# Altium schematic sheet SCH_TOP.SchDoc: TP Final - Reloj - BLK
size A4; Author: Luciano Lopez; CompanyName: UTN - FRBA; Revision: 1; SheetNumber: 1; SheetTotal: 10
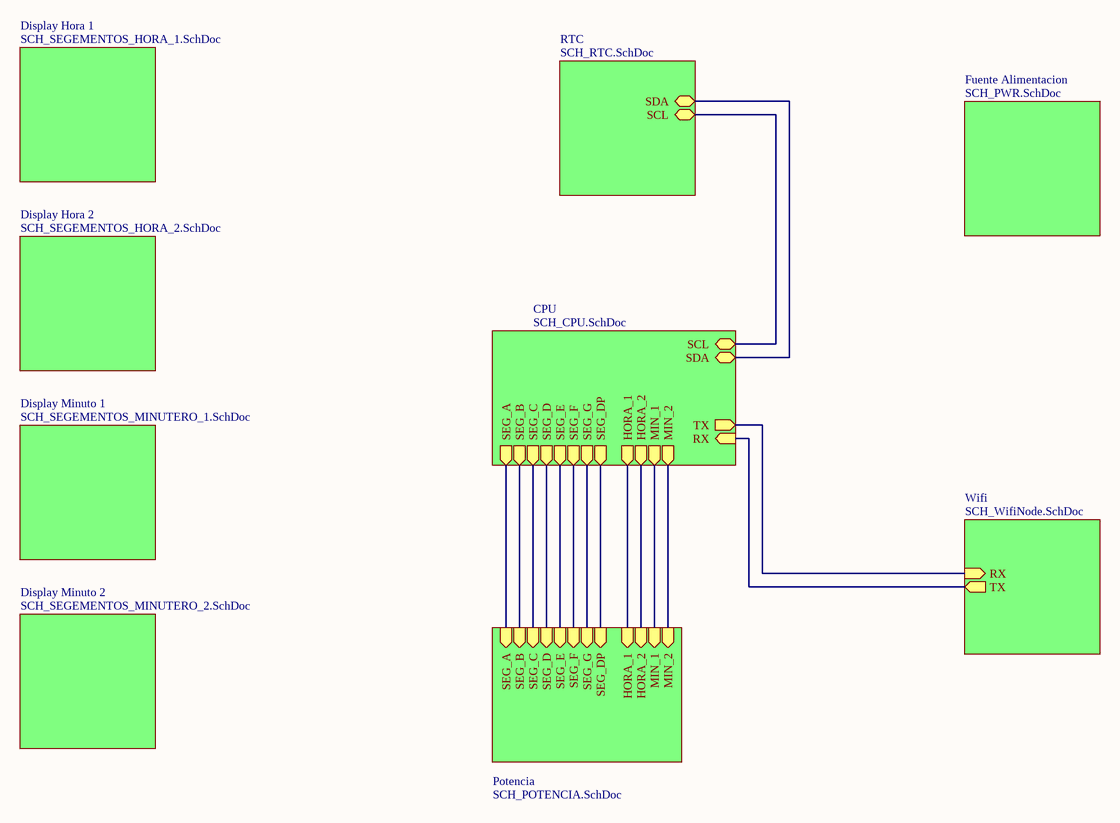
[diagram p0: SCH_TOP.SchDoc]

## Sub-sheets
CPU = SCH_CPU.SchDoc: SCL (bidir), SDA (bidir), TX (out), RX (in), HORA_2 (out), HORA_1 (out), SEG_G (out), SEG_F (out), SEG_D (out), SEG_E (out), SEG_C (out), SEG_B (out), SEG_A (out), MIN_1 (out), MIN_2 (out), SEG_DP (out)
Display Hora 1 = SCH_SEGEMENTOS_HORA_1.SchDoc: no entries
Display Hora 2 = SCH_SEGEMENTOS_HORA_2.SchDoc: no entries
Display Minuto 1 = SCH_SEGEMENTOS_MINUTERO_1.SchDoc: no entries
Display Minuto 2 = SCH_SEGEMENTOS_MINUTERO_2.SchDoc: no entries
Fuente Alimentacion = SCH_PWR.SchDoc: no entries
Potencia = SCH_POTENCIA.SchDoc: SEG_B (in), SEG_C (in), SEG_D (in), SEG_E (in), SEG_G (in), SEG_F (in), SEG_DP (in), HORA_1 (in), HORA_2 (in), MIN_1 (in), MIN_2 (in), SEG_A (in)
RTC = SCH_RTC.SchDoc: SDA (bidir), SCL (bidir)
Wifi = SCH_WifiNode.SchDoc: TX (out), RX (in)

## Nets
(unnamed): sheet CPU/SCL, sheet RTC/SCL
(unnamed): sheet CPU/SDA, sheet RTC/SDA
(unnamed): sheet CPU/TX, sheet Wifi/RX
(unnamed): sheet CPU/RX, sheet Wifi/TX
(unnamed): sheet CPU/HORA_2, sheet Potencia/HORA_2
(unnamed): sheet CPU/HORA_1, sheet Potencia/HORA_1
(unnamed): sheet CPU/SEG_G, sheet Potencia/SEG_G
(unnamed): sheet CPU/SEG_F, sheet Potencia/SEG_F
(unnamed): sheet CPU/SEG_D, sheet Potencia/SEG_D
(unnamed): sheet CPU/SEG_E, sheet Potencia/SEG_E
(unnamed): sheet CPU/SEG_C, sheet Potencia/SEG_C
(unnamed): sheet CPU/SEG_B, sheet Potencia/SEG_B
(unnamed): sheet CPU/SEG_A, sheet Potencia/SEG_A
(unnamed): sheet CPU/MIN_1, sheet Potencia/MIN_1
(unnamed): sheet CPU/MIN_2, sheet Potencia/MIN_2
(unnamed): sheet CPU/SEG_DP, sheet Potencia/SEG_DP

## Notes on the sheet
- Title:
- Size:
- Author:
- A4
- Sheet
- of
- Revision:
- File:
- Date: